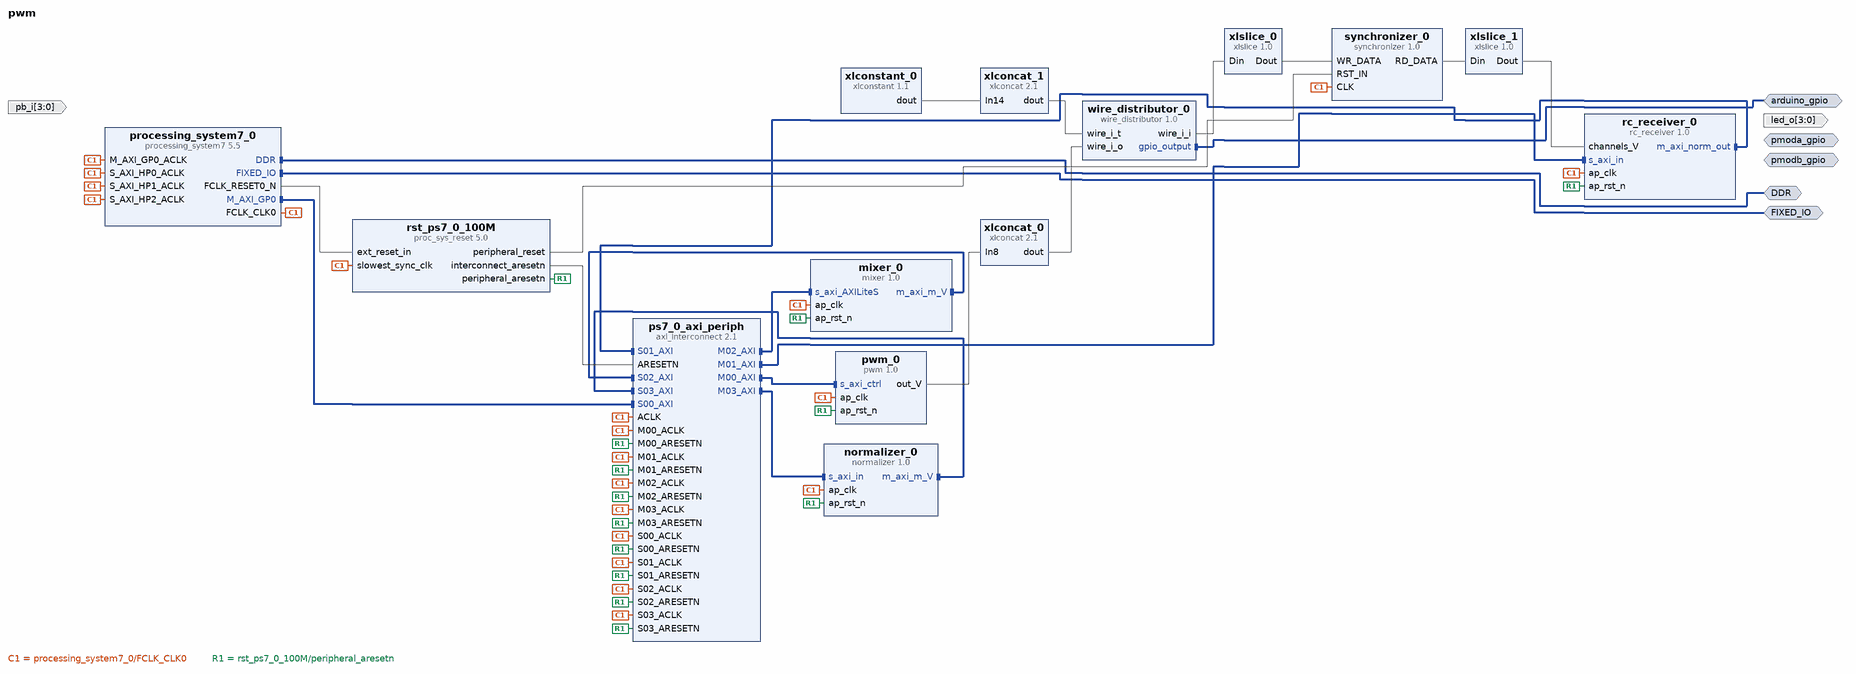
[diagram p0: block diagram of the top level]
# Vivado block design pwm, xc7z020clg400-1, Vivado 2017.4
create_bd_design pwm

create_bd_intf_port -mode Master -vlnv xilinx.com:interface:ddrx_rtl:1.0 DDR
create_bd_intf_port -mode Master -vlnv xilinx.com:display_processing_system7:fixedio_rtl:1.0 FIXED_IO
create_bd_intf_port -mode Master -vlnv xilinx.com:interface:gpio_rtl:1.0 arduino_gpio
create_bd_intf_port -mode Master -vlnv xilinx.com:interface:gpio_rtl:1.0 pmoda_gpio
create_bd_intf_port -mode Master -vlnv xilinx.com:interface:gpio_rtl:1.0 pmodb_gpio
create_bd_port -dir O -from 3 -to 0 led_o
create_bd_port -dir I -from 3 -to 0 pb_i

create_bd_cell -type ip -vlnv UCSD:hlsip:mixer:1.0 mixer_0
set_property -dict {CONFIG.C_M_AXI_M_V_TARGET_ADDR 0x4000F030} [get_bd_cells mixer_0]
create_bd_cell -type ip -vlnv UCSD:hlsip:normalizer:1.0 normalizer_0
set_property -dict {CONFIG.C_M_AXI_M_V_TARGET_ADDR 0x4000e010} [get_bd_cells normalizer_0]
create_bd_cell -type ip -vlnv xilinx.com:ip:processing_system7:5.5 processing_system7_0
set_property -dict [list \
  CONFIG.PCW_FCLK_CLK1_BUF TRUE \
  CONFIG.PCW_UIPARAM_DDR_FREQ_MHZ 525 \
  CONFIG.PCW_CRYSTAL_PERIPHERAL_FREQMHZ 50 \
  CONFIG.PCW_APU_PERIPHERAL_FREQMHZ 650 \
  CONFIG.PCW_SDIO_PERIPHERAL_FREQMHZ 50 \
  CONFIG.PCW_UART_PERIPHERAL_FREQMHZ 100 \
  CONFIG.PCW_FPGA0_PERIPHERAL_FREQMHZ 100 \
  CONFIG.PCW_FPGA1_PERIPHERAL_FREQMHZ 50 \
  CONFIG.PCW_FPGA2_PERIPHERAL_FREQMHZ 100 \
  CONFIG.PCW_FPGA3_PERIPHERAL_FREQMHZ 160 \
  CONFIG.PCW_USE_S_AXI_HP0 1 \
  CONFIG.PCW_USE_S_AXI_HP1 1 \
  CONFIG.PCW_USE_S_AXI_HP2 1 \
  CONFIG.PCW_USE_FABRIC_INTERRUPT 1 \
  CONFIG.PCW_GPIO_EMIO_GPIO_WIDTH 7 \
  CONFIG.PCW_EN_CLK1_PORT 1 \
  CONFIG.PCW_IRQ_F2P_INTR 1 \
  CONFIG.PCW_GP0_EN_MODIFIABLE_TXN 0 \
  CONFIG.PCW_GP1_EN_MODIFIABLE_TXN 0 \
  CONFIG.PCW_PERIPHERAL_BOARD_PRESET None \
  CONFIG.PCW_PRESET_BANK1_VOLTAGE {LVCMOS 1.8V} \
  CONFIG.PCW_UIPARAM_DDR_BUS_WIDTH {16 Bit} \
  CONFIG.PCW_UIPARAM_DDR_PARTNO Custom \
  CONFIG.PCW_QSPI_PERIPHERAL_ENABLE 1 \
  CONFIG.PCW_QSPI_QSPI_IO {MIO 1 .. 6} \
  CONFIG.PCW_QSPI_GRP_SINGLE_SS_ENABLE 1 \
  CONFIG.PCW_QSPI_GRP_SINGLE_SS_IO {MIO 1 .. 6} \
  CONFIG.PCW_SINGLE_QSPI_DATA_MODE x4 \
  CONFIG.PCW_QSPI_GRP_FBCLK_ENABLE 1 \
  CONFIG.PCW_QSPI_GRP_FBCLK_IO {MIO 8} \
  CONFIG.PCW_ENET0_PERIPHERAL_ENABLE 1 \
  CONFIG.PCW_ENET0_ENET0_IO {MIO 16 .. 27} \
  CONFIG.PCW_ENET0_GRP_MDIO_ENABLE 1 \
  CONFIG.PCW_ENET0_GRP_MDIO_IO {MIO 52 .. 53} \
  CONFIG.PCW_SD0_PERIPHERAL_ENABLE 1 \
  CONFIG.PCW_SD0_SD0_IO {MIO 40 .. 45} \
  CONFIG.PCW_SD0_GRP_CD_ENABLE 1 \
  CONFIG.PCW_SD0_GRP_CD_IO {MIO 47} \
  CONFIG.PCW_SD0_GRP_WP_ENABLE 0 \
  CONFIG.PCW_UART0_PERIPHERAL_ENABLE 1 \
  CONFIG.PCW_UART0_UART0_IO {MIO 14 .. 15} \
  CONFIG.PCW_UART1_PERIPHERAL_ENABLE 0 \
  CONFIG.PCW_USB0_PERIPHERAL_ENABLE 1 \
  CONFIG.PCW_USB0_USB0_IO {MIO 28 .. 39} \
  CONFIG.PCW_GPIO_MIO_GPIO_ENABLE 0 \
  CONFIG.PCW_GPIO_EMIO_GPIO_ENABLE 1 \
  CONFIG.PCW_GPIO_EMIO_GPIO_IO 7 \
  CONFIG.PCW_FPGA_FCLK1_ENABLE 1 \
] [get_bd_cells processing_system7_0]
# 479 more settings of processing_system7_0 are not shown: defaults, MIO pin electricals, DDR timing, and values the tool derives
create_bd_cell -type ip -vlnv xilinx.com:ip:axi_interconnect:2.1 ps7_0_axi_periph
set_property -dict {CONFIG.NUM_SI 4 CONFIG.NUM_MI 4} [get_bd_cells ps7_0_axi_periph]
create_bd_cell -type ip -vlnv UCSD:hlsip:pwm:1.0 pwm_0
create_bd_cell -type ip -vlnv UCSD:hlsip:rc_receiver:1.0 rc_receiver_0
set_property -dict {CONFIG.C_M_AXI_NORM_OUT_TARGET_ADDR 0x4000d010} [get_bd_cells rc_receiver_0]
create_bd_cell -type ip -vlnv xilinx.com:ip:proc_sys_reset:5.0 rst_ps7_0_100M
create_bd_cell -type ip -vlnv ucsd.edu:ip:synchronizer:1.0 synchronizer_0
set_property -dict {CONFIG.C_DEPTH 100 CONFIG.C_DATA_WIDTH 6} [get_bd_cells synchronizer_0]
create_bd_cell -type ip -vlnv xilinx.com:user:wire_distributor:1.0 wire_distributor_0
set_property -dict {CONFIG.TYPE 1 CONFIG.WIDTH 20} [get_bd_cells wire_distributor_0]
create_bd_cell -type ip -vlnv xilinx.com:ip:xlconcat:2.1 xlconcat_0
set_property -dict {CONFIG.NUM_PORTS 15 CONFIG.IN0_WIDTH 1 CONFIG.IN8_WIDTH 6} [get_bd_cells xlconcat_0]
create_bd_cell -type ip -vlnv xilinx.com:ip:xlconcat:2.1 xlconcat_1
set_property -dict {CONFIG.NUM_PORTS 15 CONFIG.IN0_WIDTH 1 CONFIG.IN14_WIDTH 6} [get_bd_cells xlconcat_1]
create_bd_cell -type ip -vlnv xilinx.com:ip:xlconstant:1.1 xlconstant_0
set_property -dict {CONFIG.CONST_WIDTH 6 CONFIG.CONST_VAL 0x3F} [get_bd_cells xlconstant_0]
create_bd_cell -type ip -vlnv xilinx.com:ip:xlslice:1.0 xlslice_0
set_property -dict {CONFIG.DIN_TO 14 CONFIG.DIN_FROM 19 CONFIG.DIN_WIDTH 20 CONFIG.DOUT_WIDTH 6} [get_bd_cells xlslice_0]
create_bd_cell -type ip -vlnv xilinx.com:ip:xlslice:1.0 xlslice_1
set_property -dict {CONFIG.DIN_TO 600 CONFIG.DIN_FROM 605 CONFIG.DIN_WIDTH 606 CONFIG.DOUT_WIDTH 1} [get_bd_cells xlslice_1]

# ---- connections ----

connect_bd_intf_net [get_bd_intf_pins mixer_0/m_axi_m_V] [get_bd_intf_pins ps7_0_axi_periph/S02_AXI]
connect_bd_intf_net [get_bd_intf_pins normalizer_0/m_axi_m_V] [get_bd_intf_pins ps7_0_axi_periph/S03_AXI]
connect_bd_intf_net [get_bd_intf_pins processing_system7_0/M_AXI_GP0] [get_bd_intf_pins ps7_0_axi_periph/S00_AXI]
connect_bd_intf_net [get_bd_intf_pins ps7_0_axi_periph/M00_AXI] [get_bd_intf_pins pwm_0/s_axi_ctrl]
connect_bd_intf_net [get_bd_intf_pins ps7_0_axi_periph/M01_AXI] [get_bd_intf_pins rc_receiver_0/s_axi_in]
connect_bd_intf_net [get_bd_intf_pins mixer_0/s_axi_AXILiteS] [get_bd_intf_pins ps7_0_axi_periph/M02_AXI]
connect_bd_intf_net [get_bd_intf_pins normalizer_0/s_axi_in] [get_bd_intf_pins ps7_0_axi_periph/M03_AXI]
connect_bd_intf_net -intf_net rc_receiver_0_m_axi_out_V [get_bd_intf_pins ps7_0_axi_periph/S01_AXI] [get_bd_intf_pins rc_receiver_0/m_axi_norm_out]
connect_bd_intf_net [get_bd_intf_ports DDR] [get_bd_intf_pins processing_system7_0/DDR]
connect_bd_intf_net [get_bd_intf_ports FIXED_IO] [get_bd_intf_pins processing_system7_0/FIXED_IO]
connect_bd_intf_net [get_bd_intf_ports arduino_gpio] [get_bd_intf_pins wire_distributor_0/gpio_output]
connect_bd_net [get_bd_pins processing_system7_0/FCLK_CLK0] \
  [get_bd_pins mixer_0/ap_clk] [get_bd_pins normalizer_0/ap_clk] [get_bd_pins processing_system7_0/M_AXI_GP0_ACLK] \
  [get_bd_pins processing_system7_0/S_AXI_HP0_ACLK] [get_bd_pins processing_system7_0/S_AXI_HP1_ACLK] \
  [get_bd_pins processing_system7_0/S_AXI_HP2_ACLK] [get_bd_pins ps7_0_axi_periph/ACLK] \
  [get_bd_pins ps7_0_axi_periph/M00_ACLK] [get_bd_pins ps7_0_axi_periph/M01_ACLK] [get_bd_pins ps7_0_axi_periph/M02_ACLK] \
  [get_bd_pins ps7_0_axi_periph/M03_ACLK] [get_bd_pins ps7_0_axi_periph/S00_ACLK] [get_bd_pins ps7_0_axi_periph/S01_ACLK] \
  [get_bd_pins ps7_0_axi_periph/S02_ACLK] [get_bd_pins ps7_0_axi_periph/S03_ACLK] [get_bd_pins pwm_0/ap_clk] \
  [get_bd_pins rc_receiver_0/ap_clk] [get_bd_pins rst_ps7_0_100M/slowest_sync_clk] [get_bd_pins synchronizer_0/CLK]
connect_bd_net [get_bd_pins processing_system7_0/FCLK_RESET0_N] [get_bd_pins rst_ps7_0_100M/ext_reset_in]
connect_bd_net [get_bd_pins pwm_0/out_V] [get_bd_pins xlconcat_0/In8]
connect_bd_net [get_bd_pins rst_ps7_0_100M/interconnect_aresetn] [get_bd_pins ps7_0_axi_periph/ARESETN]
connect_bd_net [get_bd_pins rst_ps7_0_100M/peripheral_aresetn] \
  [get_bd_pins mixer_0/ap_rst_n] [get_bd_pins normalizer_0/ap_rst_n] [get_bd_pins ps7_0_axi_periph/M00_ARESETN] \
  [get_bd_pins ps7_0_axi_periph/M01_ARESETN] [get_bd_pins ps7_0_axi_periph/M02_ARESETN] \
  [get_bd_pins ps7_0_axi_periph/M03_ARESETN] [get_bd_pins ps7_0_axi_periph/S00_ARESETN] \
  [get_bd_pins ps7_0_axi_periph/S01_ARESETN] [get_bd_pins ps7_0_axi_periph/S02_ARESETN] \
  [get_bd_pins ps7_0_axi_periph/S03_ARESETN] [get_bd_pins pwm_0/ap_rst_n] [get_bd_pins rc_receiver_0/ap_rst_n]
connect_bd_net [get_bd_pins rst_ps7_0_100M/peripheral_reset] [get_bd_pins synchronizer_0/RST_IN]
connect_bd_net [get_bd_pins synchronizer_0/RD_DATA] [get_bd_pins xlslice_1/Din]
connect_bd_net [get_bd_pins wire_distributor_0/wire_i_i] [get_bd_pins xlslice_0/Din]
connect_bd_net [get_bd_pins xlconcat_0/dout] [get_bd_pins wire_distributor_0/wire_i_o]
connect_bd_net [get_bd_pins xlconcat_1/dout] [get_bd_pins wire_distributor_0/wire_i_t]
connect_bd_net [get_bd_pins xlconstant_0/dout] [get_bd_pins xlconcat_1/In14]
connect_bd_net [get_bd_pins xlslice_0/Dout] [get_bd_pins synchronizer_0/WR_DATA]
connect_bd_net [get_bd_pins xlslice_1/Dout] [get_bd_pins rc_receiver_0/channels_V]

# ---- address map ----
assign_bd_address -offset 0x4000F000 -range 4K -target_address_space [get_bd_addr_spaces mixer_0/Data_m_axi_m_V] [get_bd_addr_segs pwm_0/s_axi_ctrl/Reg]
exclude_bd_addr_seg -offset 0x4000D000 -range 4K -target_address_space [get_bd_addr_spaces mixer_0/Data_m_axi_m_V] [get_bd_addr_segs normalizer_0/s_axi_in/Reg]
assign_bd_address -offset 0x4000E000 -range 4K -target_address_space [get_bd_addr_spaces normalizer_0/Data_m_axi_m_V] [get_bd_addr_segs mixer_0/s_axi_AXILiteS/Reg]
exclude_bd_addr_seg -offset 0x4000C000 -range 4K -target_address_space [get_bd_addr_spaces normalizer_0/Data_m_axi_m_V] [get_bd_addr_segs rc_receiver_0/s_axi_in/Reg]
exclude_bd_addr_seg -offset 0x4000D000 -range 4K -target_address_space [get_bd_addr_spaces normalizer_0/Data_m_axi_m_V] [get_bd_addr_segs normalizer_0/s_axi_in/Reg]
exclude_bd_addr_seg -offset 0x4000F000 -range 4K -target_address_space [get_bd_addr_spaces normalizer_0/Data_m_axi_m_V] [get_bd_addr_segs pwm_0/s_axi_ctrl/Reg]
assign_bd_address -offset 0x4000C000 -range 4K -target_address_space [get_bd_addr_spaces processing_system7_0/Data] [get_bd_addr_segs rc_receiver_0/s_axi_in/Reg]
assign_bd_address -offset 0x4000D000 -range 4K -target_address_space [get_bd_addr_spaces processing_system7_0/Data] [get_bd_addr_segs normalizer_0/s_axi_in/Reg]
assign_bd_address -offset 0x4000E000 -range 4K -target_address_space [get_bd_addr_spaces processing_system7_0/Data] [get_bd_addr_segs mixer_0/s_axi_AXILiteS/Reg]
assign_bd_address -offset 0x4000F000 -range 4K -target_address_space [get_bd_addr_spaces processing_system7_0/Data] [get_bd_addr_segs pwm_0/s_axi_ctrl/Reg]
assign_bd_address -offset 0x4000D000 -range 4K -target_address_space [get_bd_addr_spaces rc_receiver_0/Data_m_axi_norm_out] [get_bd_addr_segs normalizer_0/s_axi_in/Reg]
exclude_bd_addr_seg -offset 0x4000C000 -range 4K -target_address_space [get_bd_addr_spaces rc_receiver_0/Data_m_axi_norm_out] [get_bd_addr_segs rc_receiver_0/s_axi_in/Reg]
exclude_bd_addr_seg -offset 0x4000E000 -range 4K -target_address_space [get_bd_addr_spaces rc_receiver_0/Data_m_axi_norm_out] [get_bd_addr_segs mixer_0/s_axi_AXILiteS/Reg]
exclude_bd_addr_seg -offset 0x4000F000 -range 4K -target_address_space [get_bd_addr_spaces rc_receiver_0/Data_m_axi_norm_out] [get_bd_addr_segs pwm_0/s_axi_ctrl/Reg]

validate_bd_design
save_bd_design
